# EAGLE schematic Rev4 (EAGLE 6.5.0)
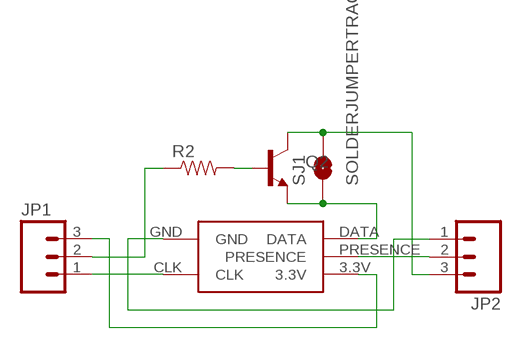
[diagram p0: schematic, sheet 1]

## Parts
JP1  M03PTH  [1X03]
JP2  M03PTH  [1X03]
Q2  TRANSISTOR_NPNSOT23  [SOT23]
R2  RESISTOR0603  [0603-RES]
SJ1  SOLDERJUMPERTRACE  [SJ_2S-TRACE]
U$1  NUNCHUCKLOCL  [NUNCHUCK-LOCK]

## Nets
3.3V: JP1.3 U$1.3.3V
EN: JP1.2 R2.1
GND: JP2.1 U$1.GND
N$1: Q2.1(B) R2.2
N$6: JP2.3 Q2.3(C) SJ1.2
PRES: JP2.2 U$1.PRESENCE
SCL: JP1.1 U$1.CLK
SDA: Q2.2(E) SJ1.1 U$1.DATA

## Library data of the parts
JP1 JP2 = SparkFun-Connectors:M03: Header 3 Standard 3-pin 0.1" header. Use with straight break away headers (SKU : PRT-00116), right angle break away headers (PRT-00553), swiss pins (PRT-00743), machine pins (PRT-00117), and female headers (PRT-00115). Molex polarized connector foot print use with SKU : PRT-08232 with associated crimp pins and housings.
Q2 = SparkFun-DiscreteSemi:TRANSISTOR_NPN: Generic NPN BJT MMBT2222A - TRANS-08049 (SOT-23, 1A 40V) MPSA42 - TRANS-09116 (SOT-23, 500mA 300V) MMBT5088LT1G - TRANS-11160 (SOT-23, 50 mA 30V)
R2 = SparkFun-Resistors:RESISTOR: Resistor Basic schematic elements and footprints for 0603, 1206, and PTH resistors.
SJ1 = SparkFun-Passives:SOLDERJUMPER: Solder Jumper Standard SMD solder jumper. Used to automate production. Two varients : Normally Open and Normally Closed are the same, but have different paste layers. NC will have a large amount of paste and should jumper during reflow.
U$1 = HHJ:NUNCHUCK